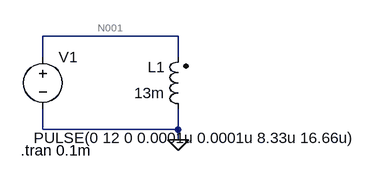
[diagram p0: schematic Draft2.asc]
Draft2.asc, the LTspice schematic file:
Version 4
SHEET 1 880 680
WIRE 256 80 48 80
WIRE 48 112 48 80
WIRE 256 112 256 80
WIRE 48 224 48 192
WIRE 256 224 256 192
WIRE 256 224 48 224
WIRE 256 240 256 224
FLAG 256 240 0
SYMBOL voltage 48 96 R0
WINDOW 3 -14 141 Left 2
WINDOW 123 0 0 Left 0
WINDOW 39 0 0 Left 0
SYMATTR InstName V1
SYMATTR Value PULSE(0 12 0 0.0001u 0.0001u 8.33u 16.66u)
SYMBOL ind2 272 208 R180
WINDOW 0 36 80 Left 2
WINDOW 3 36 40 Left 2
SYMATTR InstName L1
SYMATTR Value 13m
SYMATTR Type ind
TEXT 14 256 Left 2 !.tran 0.1m

The netlist it stands for:
* Draft2.asc
V1 N001 0 PULSE(0 12 0 0.0001u 0.0001u 8.33u 16.66u)
L1 0 N001 13m
.tran 0.1m
.backanno
.end

* Results of the author's LTspice run, read from the files saved beside the schematic
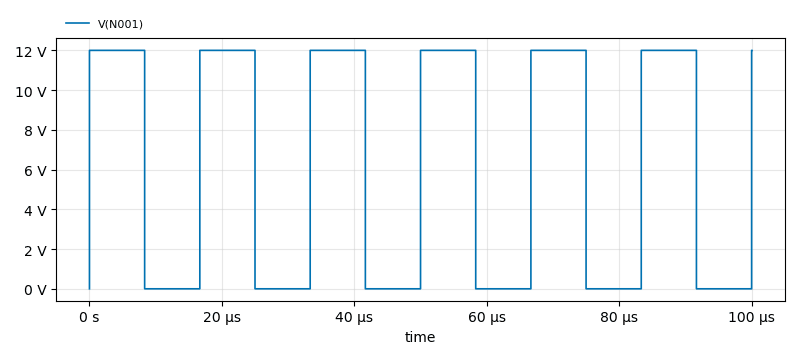
[diagram p1: Transient Analysis of Draft2.asc, plotted from the saved traces]
* Transient Analysis, 1 run:
*   V(N001): min 0 V, max 12 V, average 6.002 V, rms 8.487 V, last 12 V